# Altium schematic sheet DZ_Scheme.SchDoc
size 420 x 297 mm; SheetNumber: 1; SheetTotal: 1
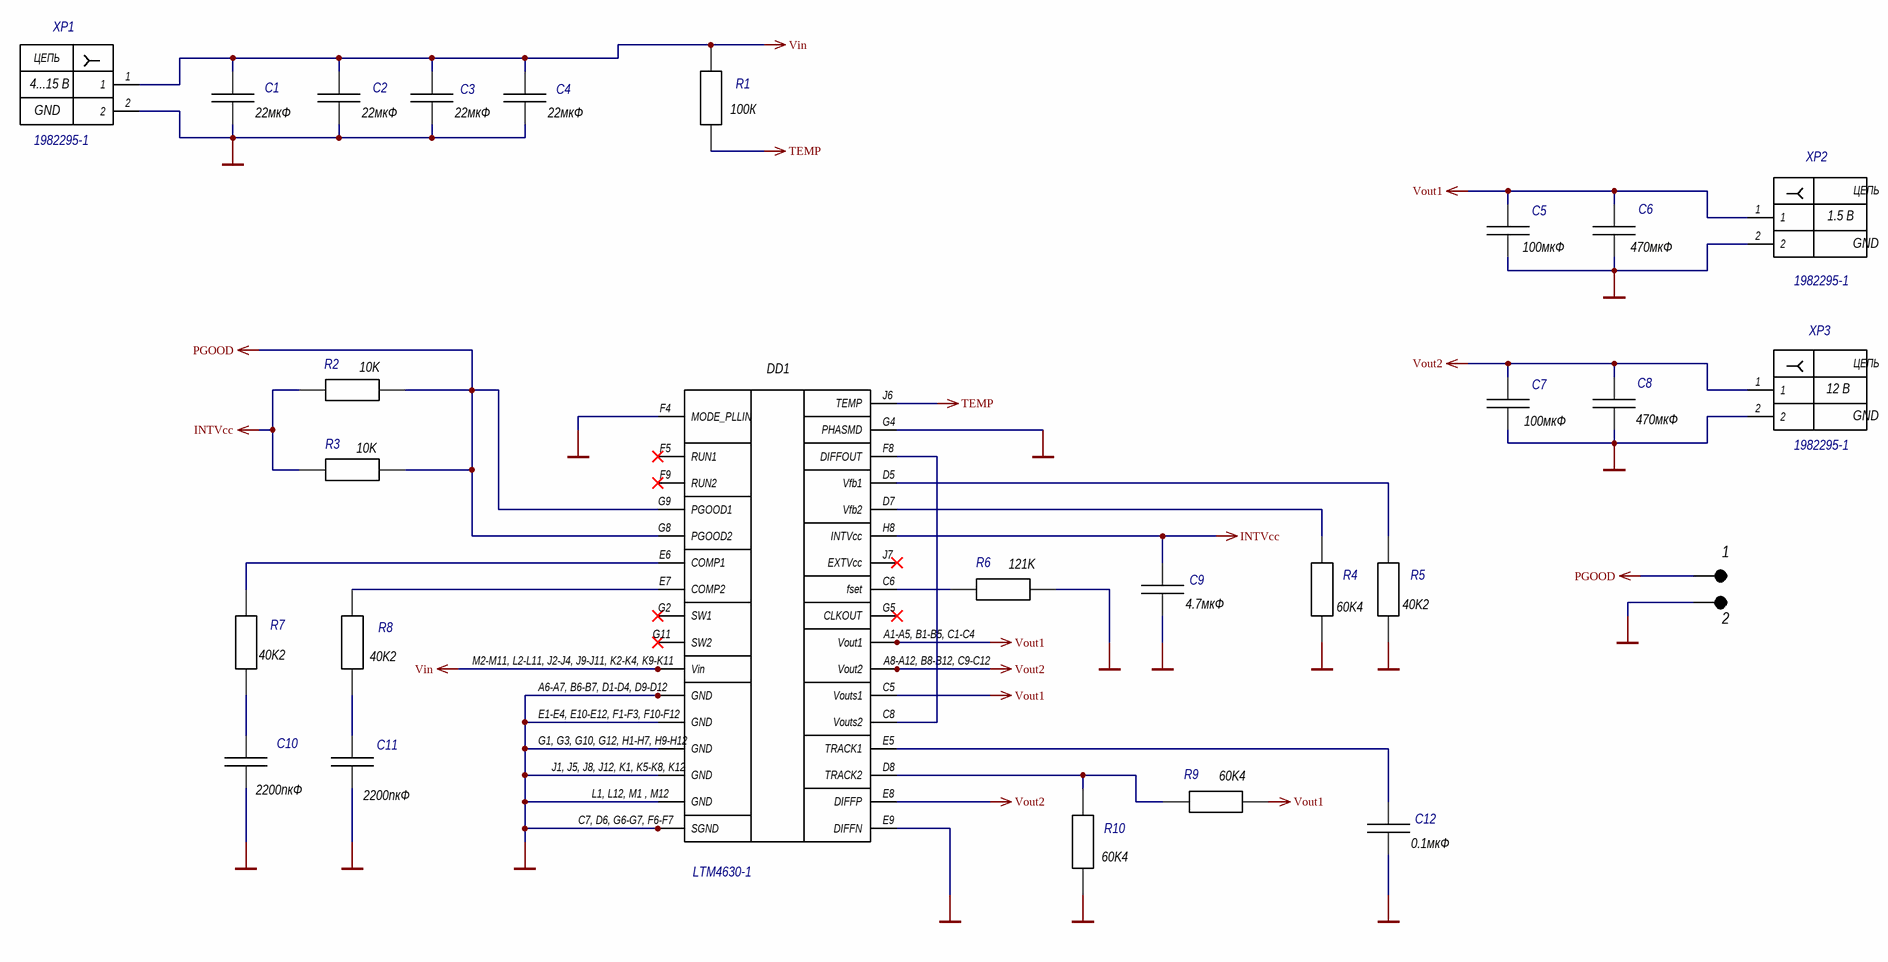
[diagram p0: DZ_Scheme.SchDoc]

## Parts
*  TEST_PINS  [TEST_ZONE]  (value not drawn)
C1  Parameter 1: 22мкФ  [CAP: 0805]  (hidden comment: Capasitor)
C2  Parameter 1: 22мкФ  [CAP: 0805]  (hidden comment: Capasitor)
C3  Parameter 1: 22мкФ  [CAP: 0805]  (hidden comment: Capasitor)
C4  Parameter 1: 22мкФ  [CAP: 0805]  (hidden comment: Capasitor)
C5  Parameter 1: 100мкФ  [CAP: 0805]  (hidden comment: Capasitor)
C6  Parameter 1: 470мкФ  [CAP: 0805]  (hidden comment: Capasitor)
C7  Parameter 1: 100мкФ  [CAP: 0805]  (hidden comment: Capasitor)
C8  Parameter 1: 470мкФ  [CAP: 0805]  (hidden comment: Capasitor)
C9  Parameter 1: 4.7мкФ  [CAP: 0805]  (hidden comment: Capasitor)
C10  Parameter 1: 2200пкФ  [CAP: 0805]  (hidden comment: Capasitor)
C11  Parameter 1: 2200пкФ  [CAP: 0805]  (hidden comment: Capasitor)
C12  Parameter 1: 0.1мкФ  [CAP: 0805]  (hidden comment: Capasitor)
DD1  LTM4630-1  [BGA144C127P12X12_1600X1600X501]
R1  Parameter 1: 100К  [RES: 1206]  (hidden comment: Resistor)
R2  Parameter 1: 10K  [RES: 1206]  (hidden comment: Resistor)
R3  Parameter 1: 10K  [RES: 1206]  (hidden comment: Resistor)
R4  Parameter 1: 60K4  [RES: 1206]  (hidden comment: Resistor)
R5  Parameter 1: 40K2  [RES: 1206]  (hidden comment: Resistor)
R6  Parameter 1: 121K  [RES: 1206]  (hidden comment: Resistor)
R7  Parameter 1: 40K2  [RES: 1206]  (hidden comment: Resistor)
R8  Parameter 1: 40K2  [RES: 1206]  (hidden comment: Resistor)
R9  Parameter 1: 60K4  [RES: 1206]  (hidden comment: Resistor)
R10  Parameter 1: 60K4  [RES: 1206]  (hidden comment: Resistor)
XP1  1982295-1  [19822951]
XP2  1982295-1  [19822951]
XP3  1982295-1  [19822951]

## Nets
GND: *.2 C1.1 C2.1 C3.1 C4.1 C5.1 C6.2 C7.1 C8.2 C9.1 C10.1 C11.2 C12.1 DD1.A6(GND) DD1.A7(GND) DD1.B6(GND) DD1.B7(GND) DD1.C7(SGND) DD1.D1(GND) DD1.D2(GND) DD1.D3(GND) DD1.D4(GND) DD1.D6(SGND) DD1.D9(GND) DD1.D10(GND) DD1.D11(GND) DD1.D12(GND) DD1.E1(GND) DD1.E2(GND) DD1.E3(GND) DD1.E4(GND) DD1.E9(DIFFN) DD1.E10(GND) DD1.E11(GND) DD1.E12(GND) DD1.F1(GND) DD1.F2(GND) DD1.F3(GND) DD1.F4(MODE_PLLIN) DD1.F6(SGND) DD1.F7(SGND) DD1.F10(GND) DD1.F11(GND) DD1.F12(GND) DD1.G1(GND) DD1.G3(GND) DD1.G4(PHASMD) DD1.G6(SGND) DD1.G7(SGND) DD1.G10(GND) DD1.G12(GND) DD1.H1(GND) DD1.H2(GND) DD1.H3(GND) DD1.H4(GND) DD1.H5(GND) DD1.H6(GND) DD1.H7(GND) DD1.H9(GND) DD1.H10(GND) DD1.H11(GND) DD1.H12(GND) DD1.J1(GND) DD1.J5(GND) DD1.J8(GND) DD1.J12(GND) DD1.K1(GND) DD1.K5(GND) DD1.K6(GND) DD1.K7(GND) DD1.K8(GND) DD1.K12(GND) DD1.L1(GND) DD1.L12(GND) DD1.M1(GND) DD1.M12(GND) R4.1 R5.1 R6.2 R10.1 XP1.2 XP2.2 XP3.2
INTVcc: C9.2 DD1.H8(INTVcc) R2.1 R3.1
PGOOD: *.1 DD1.G8(PGOOD2) DD1.G9(PGOOD1) R2.2 R3.2
TEMP: DD1.J6(TEMP) R1.1
Vin: C1.2 C2.2 C3.2 C4.2 DD1.J2(Vin) DD1.J3(Vin) DD1.J4(Vin) DD1.J9(Vin) DD1.J10(Vin) DD1.J11(Vin) DD1.K2(Vin) DD1.K3(Vin) DD1.K4(Vin) DD1.K9(Vin) DD1.K10(Vin) DD1.K11(Vin) DD1.L2(Vin) DD1.L3(Vin) DD1.L4(Vin) DD1.L5(Vin) DD1.L6(Vin) DD1.L7(Vin) DD1.L8(Vin) DD1.L9(Vin) DD1.L10(Vin) DD1.L11(Vin) DD1.M2(Vin) DD1.M3(Vin) DD1.M4(Vin) DD1.M5(Vin) DD1.M6(Vin) DD1.M7(Vin) DD1.M8(Vin) DD1.M9(Vin) DD1.M10(Vin) DD1.M11(Vin) R1.2 XP1.1
Vout1: C5.2 C6.1 DD1.A1(Vout1) DD1.A2(Vout1) DD1.A3(Vout1) DD1.A4(Vout1) DD1.A5(Vout1) DD1.B1(Vout1) DD1.B2(Vout1) DD1.B3(Vout1) DD1.B4(Vout1) DD1.B5(Vout1) DD1.C1(Vout1) DD1.C2(Vout1) DD1.C3(Vout1) DD1.C4(Vout1) DD1.C5(Vouts1) R9.1 XP2.1
Vout2: C7.2 C8.1 DD1.A8(Vout2) DD1.A9(Vout2) DD1.A10(Vout2) DD1.A11(Vout2) DD1.A12(Vout2) DD1.B8(Vout2) DD1.B9(Vout2) DD1.B10(Vout2) DD1.B11(Vout2) DD1.B12(Vout2) DD1.C9(Vout2) DD1.C10(Vout2) DD1.C11(Vout2) DD1.C12(Vout2) DD1.E8(DIFFP) XP3.1
NetC10_2: C10.2 R7.2
NetC11_1: C11.1 R8.2
NetC12_2: C12.2 DD1.E5(TRACK1)
NetDD1_C6: DD1.C6(fset) R6.1
NetDD1_C8: DD1.C8(Vouts2) DD1.F8(DIFFOUT)
NetDD1_D5: DD1.D5(Vfb1) R5.2
NetDD1_D7: DD1.D7(Vfb2) R4.2
NetDD1_D8: DD1.D8(TRACK2) R9.2 R10.2
NetDD1_E6: DD1.E6(COMP1) R7.1
NetDD1_E7: DD1.E7(COMP2) R8.1

Not connected (* = marked no-connect by the designer): DD1 F5(RUN1)* F9(RUN2)* G2(SW1)* G5(CLKOUT)* G11(SW2)* J7(EXTVcc)*

## Notes on the sheet
- (near XP1) 4...15 В
- (near XP2) 1.5 В
- (near XP3) 12 В
- Перв. примен.
- Справ. №
- Подп. дата
- Инв. № дубл.
- Взам. инв. №
- Подп. и дата
- Изм.
- Разраб.
- Лист
- № докум.
- Подп.
- Дата
- Лит.
- Масса
- Масштаб
- Пров.
- Т.контр.
- Листов
- Инв. № подл.
- Н.контр.
- Утв.
- ALTIUM GOSTBOM2.0 KEV
- Файл:
- Копировал
- Формат А3
- (in symbol 1982295-1) ЦЕПЬ; GND
- (in symbol LTM4630-1) A1-A5, B1-B5, C1-C4; M2-M11, L2-L11, J2-J4, J9-J11, K2-K4, K9-K11; A8-A12, B8-B12, C9-C12; A6-A7, B6-B7, D1-D4, D9-D12; E1-E4, E10-E12, F1-F3, F10-F12; G1, G3, G10, G12, H1-H7, H9-H12; J1, J5, J8, J12, K1, K5-K8, K12; L1, L12, M1 , M12; C7, D6, G6-G7, F6-F7

## Library data of the parts
C1-C4 = Capasitor: Manufacturer_Name: Yageo; Manufacturer_Part_Number: CC0805MKX5R8BB226
C5 C7 = Capasitor: Manufacturer_Name: Murata; Manufacturer_Part_Number: GRM21BR60J107ME15
C6 C8 = Capasitor: Manufacturer_Name: Yageo; Manufacturer_Part_Number: CC0805KKX7R7BB474
C9 = Capasitor: Manufacturer_Name: Yageo; Manufacturer_Part_Number: CC0805KKX5R8BB475
C10 C11 = Capasitor: Manufacturer_Name: Yageo; Manufacturer_Part_Number: CC0805JKNPO9BN222
C12 = Capasitor: Manufacturer_Name: Yageo; Manufacturer_Part_Number: CC0805JRX7R8BB104
DD1 = LTM4630-1: Manufacturer_Name: LiNear; Manufacturer_Part_Number: LTM4630-1
R1 = Resistor: Manufacturer_Name: Vishay; Manufacturer_Part_Number: CRCW1206100KFKEA
R2 R3 = Resistor: Manufacturer_Name: Vishay; Manufacturer_Part_Number: CRCW120610K0FKEA
R4 R9 R10 = Resistor: Manufacturer_Name: Vishay; Manufacturer_Part_Number: CRCW120660K4FKEA
R5 R7 R8 = Resistor: Manufacturer_Name: Vishay; Manufacturer_Part_Number: CRCW120640K2FHEAP
R6 = Resistor: Manufacturer_Name: Vishay; Manufacturer_Part_Number: CRCW1206121KFHEAP
XP1-XP3 = 1982295-1: Connector; Manufacturer_Name: TE Connectivity; Datasheet Link: https://www.te.com/commerce/DocumentDelivery/DDEController?Action=srchrtrv&DocNm=1-1773894-6_ELCON_Mini_QRG_EN&DocType=Data+Sheet&DocLang=English&PartCntxt=1982295-1&DocFormat=pdf; Height: 8mm; Manufacturer_Part_Number: 1982295-1; Mouser Part Number: 571-1982295-1; Mouser Price/Stock: https://www.mouser.co.uk/ProductDetail/TE-Connectivity/1982295-1?qs=TL6PIybY3BPz%2FGEsZ%2FgbXA%3D%3D; Arrow Part Number: 1982295-1; Arrow Price/Stock: https://www.arrow.com/en/products/1982295-1/te-connectivity